# EAGLE design Backplane_v2 (EAGLE 9.6.2)
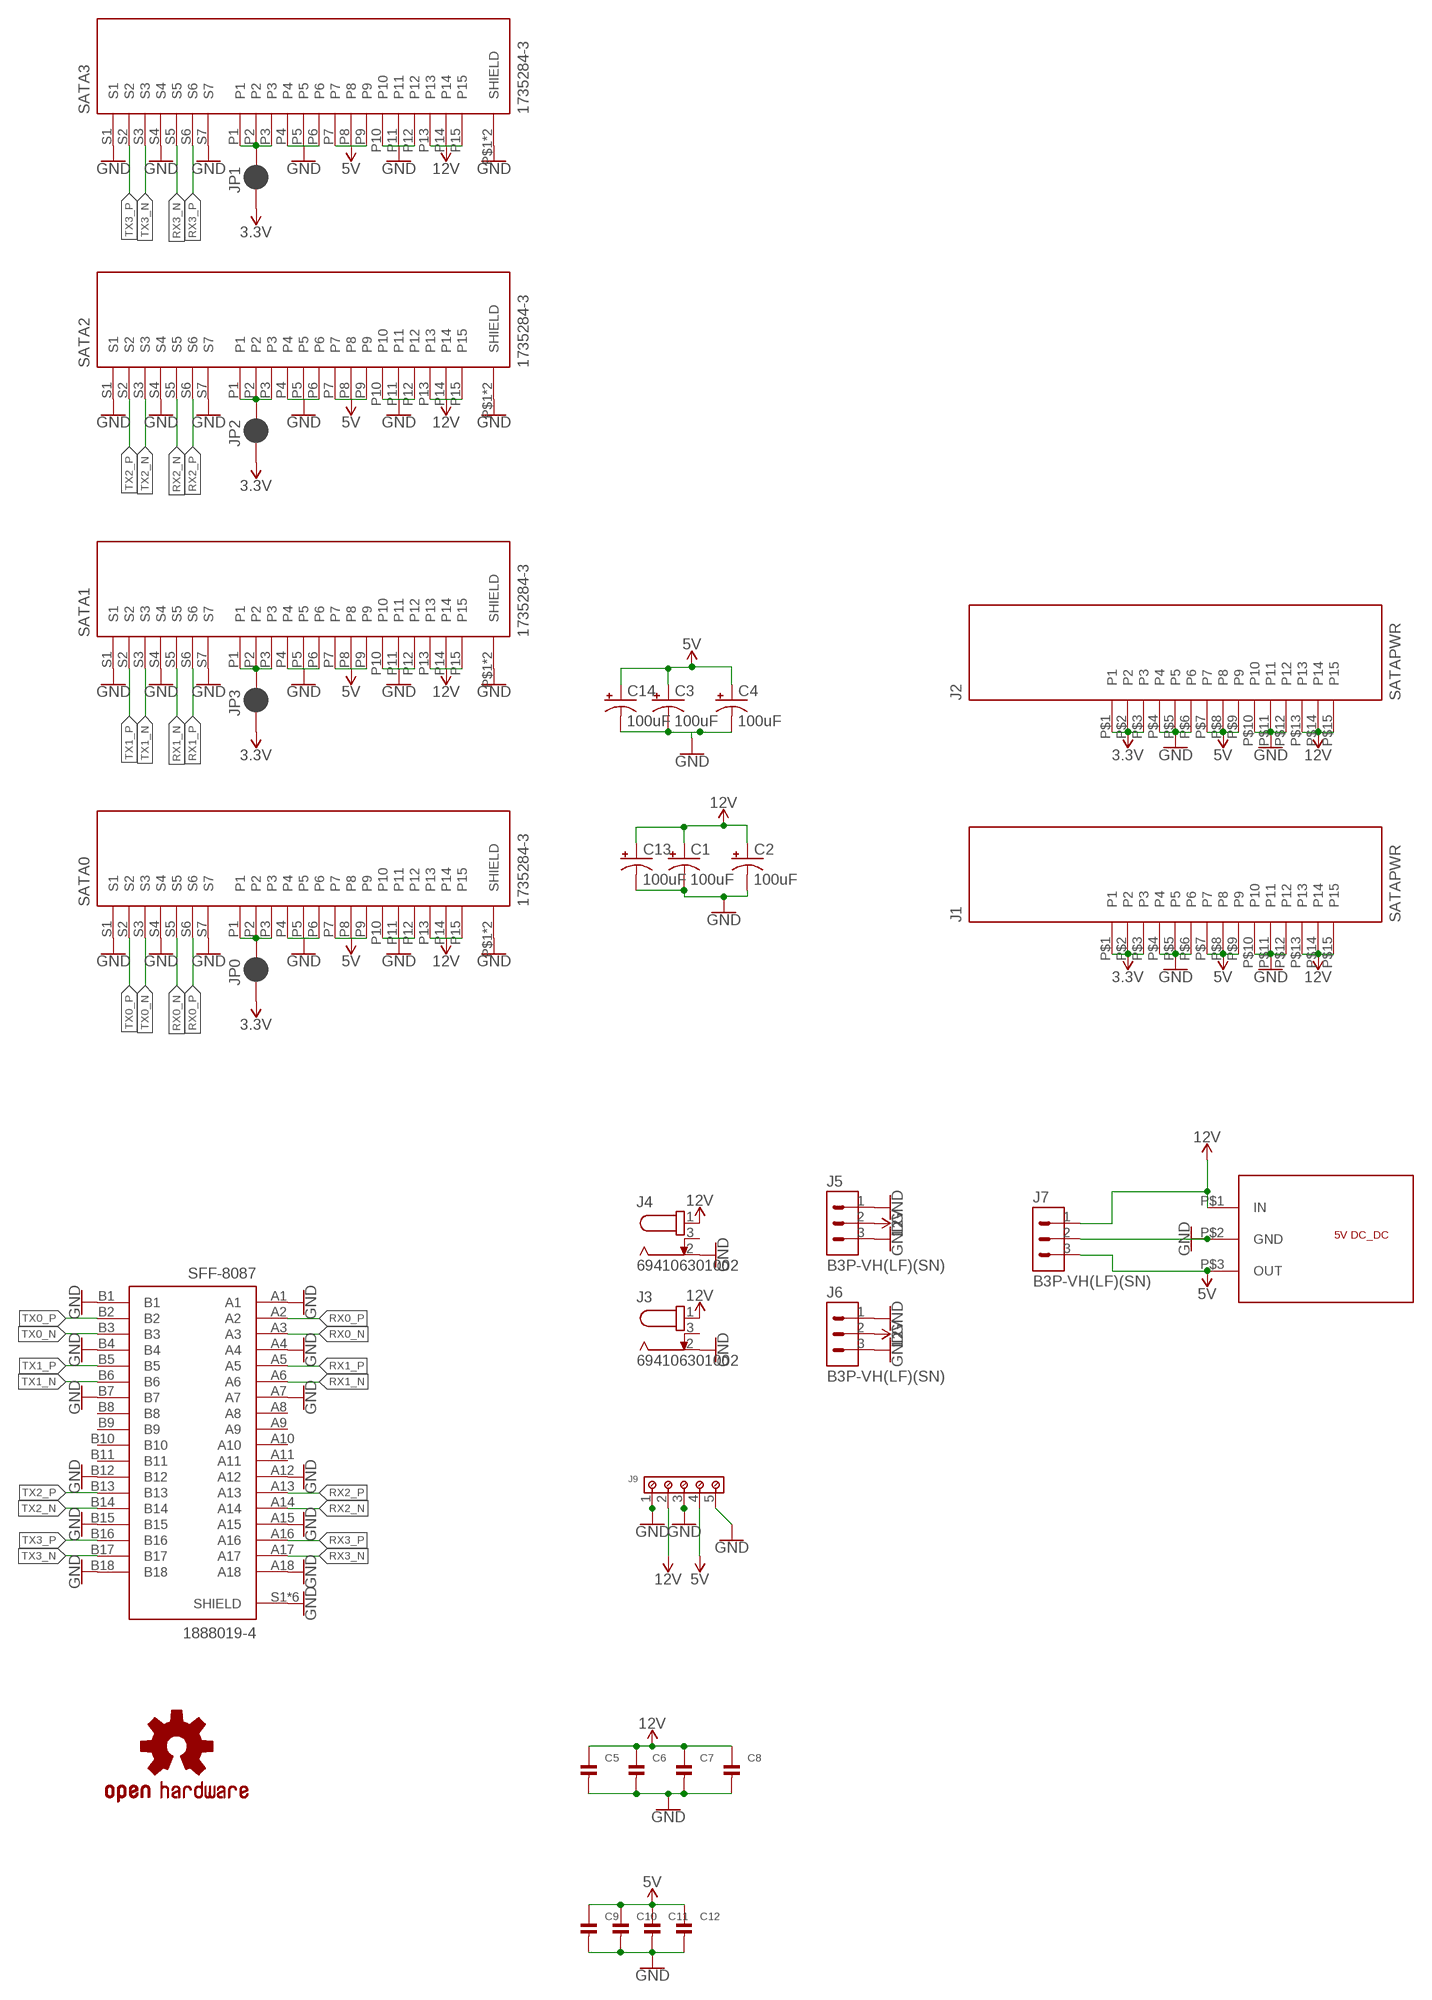
[diagram p0: schematic, sheet 1]

## Parts
C1  100uF  100UF-POLAR-25V-20%(ELEC)  [PANASONIC_D]
C2  100uF  100UF-POLAR-25V-20%(ELEC)  [PANASONIC_D]
C3  100uF  100UF-POLAR-25V-20%(ELEC)  [PANASONIC_D]
C4  100uF  100UF-POLAR-25V-20%(ELEC)  [PANASONIC_D]
C5  CAP_CERAMIC0805  [C0805]
C6  CAP_CERAMIC0805  [C0805]
C7  CAP_CERAMIC0805  [C0805]
C8  CAP_CERAMIC0805  [C0805]
C9  CAP_CERAMIC0805  [C0805]
C10  CAP_CERAMIC0805  [C0805]
C11  CAP_CERAMIC0805  [C0805]
C12  CAP_CERAMIC0805  [C0805]
C13  100uF  100UF-POLAR-25V-20%(ELEC)  [PANASONIC_D]
C14  100uF  100UF-POLAR-25V-20%(ELEC)  [PANASONIC_D]
J1  SATAPWR  [PTH_90]
J2  SATAPWR  [PTH_90]
J3  694106301002  [694106301002]
J4  694106301002  [694106301002]
J5  B3P-VH(LF)(SN)  [HDR-03]
J6  B3P-VH(LF)(SN)  [HDR-03]
J7  B3P-VH(LF)(SN)  [HDR-03]
J9  691243410005  [691243410005]
JP0  JUMPER-SMT_2_NC_PASTE_SILK  [SMT-JUMPER_2_NC_PASTE_SILK]
JP1  JUMPER-SMT_2_NC_PASTE_SILK  [SMT-JUMPER_2_NC_PASTE_SILK]
JP2  JUMPER-SMT_2_NC_PASTE_SILK  [SMT-JUMPER_2_NC_PASTE_SILK]
JP3  JUMPER-SMT_2_NC_PASTE_SILK  [SMT-JUMPER_2_NC_PASTE_SILK]
LOGO1  OSHW-LOGOL  [OSHW-LOGO-L]
SATA0  1735284-3  2023246-21735284-3  [TE_2023246-2]
SATA1  1735284-3  2023246-21735284-3  [TE_2023246-2]
SATA2  1735284-3  2023246-21735284-3  [TE_2023246-2]
SATA3  1735284-3  2023246-21735284-3  [TE_2023246-2]
SFF-8087  1888019-4  [TE_1888019-4]
U$1  5V_DC_DC  [5V_15W_DC_DC]

## Nets
3.3V: J1.P$1(P1) J1.P$2(P2) J1.P$3(P3) J2.P$1(P1) J2.P$2(P2) J2.P$3(P3) JP0.1 JP1.1 JP2.1 JP3.1
5V: C3.+ C4.+ C9.1 C10.1 C11.1 C12.1 C14.+ J1.P$7(P7) J1.P$8(P8) J1.P$9(P9) J2.P$7(P7) J2.P$8(P8) J2.P$9(P9) J7.3 J9.4 SATA0.P7 SATA0.P8 SATA0.P9 SATA1.P7 SATA1.P8 SATA1.P9 SATA2.P7 SATA2.P8 SATA2.P9 SATA3.P7 SATA3.P8 SATA3.P9 U$1.P$3(OUT)
12V: C1.+ C2.+ C5.1 C6.1 C7.1 C8.1 C13.+ J1.P$13(P13) J1.P$14(P14) J1.P$15(P15) J2.P$13(P13) J2.P$14(P14) J2.P$15(P15) J3.1 J4.1 J5.2 J6.2 J7.1 J9.2 SATA0.P13 SATA0.P14 SATA0.P15 SATA1.P13 SATA1.P14 SATA1.P15 SATA2.P13 SATA2.P14 SATA2.P15 SATA3.P13 SATA3.P14 SATA3.P15 U$1.P$1(IN)
GND: C1.- C2.- C3.- C4.- C5.2 C6.2 C7.2 C8.2 C9.2 C10.2 C11.2 C12.2 C13.- C14.- J1.P$4(P4) J1.P$5(P5) J1.P$6(P6) J1.P$10(P10) J1.P$11(P11) J1.P$12(P12) J2.P$4(P4) J2.P$5(P5) J2.P$6(P6) J2.P$10(P10) J2.P$11(P11) J2.P$12(P12) J3.2 J4.2 J5.1 J5.3 J6.1 J6.3 J7.2 J9.1 J9.3 J9.5 SATA0.P4 SATA0.P5 SATA0.P6 SATA0.P10 SATA0.P11 SATA0.P12 SATA0.P$1(SHIELD) SATA0.P$2(SHIELD) SATA0.S1 SATA0.S4 SATA0.S7 SATA1.P4 SATA1.P5 SATA1.P6 SATA1.P10 SATA1.P11 SATA1.P12 SATA1.P$1(SHIELD) SATA1.P$2(SHIELD) SATA1.S1 SATA1.S4 SATA1.S7 SATA2.P4 SATA2.P5 SATA2.P6 SATA2.P10 SATA2.P11 SATA2.P12 SATA2.P$1(SHIELD) SATA2.P$2(SHIELD) SATA2.S1 SATA2.S4 SATA2.S7 SATA3.P4 SATA3.P5 SATA3.P6 SATA3.P10 SATA3.P11 SATA3.P12 SATA3.P$1(SHIELD) SATA3.P$2(SHIELD) SATA3.S1 SATA3.S4 SATA3.S7 SFF-8087.A1 SFF-8087.A4 SFF-8087.A7 SFF-8087.A12 SFF-8087.A15 SFF-8087.A18 SFF-8087.B1 SFF-8087.B4 SFF-8087.B7 SFF-8087.B12 SFF-8087.B15 SFF-8087.B18 SFF-8087.S1(SHIELD) SFF-8087.S2(SHIELD) SFF-8087.S3(SHIELD) SFF-8087.S4(SHIELD) SFF-8087.S5(SHIELD) SFF-8087.S6(SHIELD) U$1.P$2(GND)
N$1: JP1.2 SATA3.P1 SATA3.P2 SATA3.P3
N$2: JP2.2 SATA2.P1 SATA2.P2 SATA2.P3
N$3: JP3.2 SATA1.P1 SATA1.P2 SATA1.P3
N$4: JP0.2 SATA0.P1 SATA0.P2 SATA0.P3
RX0_N [RX0]: SATA0.S5 SFF-8087.A3
RX0_P [RX0]: SATA0.S6 SFF-8087.A2
RX1_N [RX1]: SATA1.S5 SFF-8087.A6
RX1_P [RX1]: SATA1.S6 SFF-8087.A5
RX2_N [RX2]: SATA2.S5 SFF-8087.A14
RX2_P [RX2]: SATA2.S6 SFF-8087.A13
RX3_N [RX3]: SATA3.S5 SFF-8087.A17
RX3_P [RX3]: SATA3.S6 SFF-8087.A16
TX0_N [TX0]: SATA0.S3 SFF-8087.B3
TX0_P [TX0]: SATA0.S2 SFF-8087.B2
TX1_N [TX1]: SATA1.S3 SFF-8087.B6
TX1_P [TX1]: SATA1.S2 SFF-8087.B5
TX2_N [TX2]: SATA2.S3 SFF-8087.B14
TX2_P [TX2]: SATA2.S2 SFF-8087.B13
TX3_N [TX3]: SATA3.S3 SFF-8087.B17
TX3_P [TX3]: SATA3.S2 SFF-8087.B16
Unconnected: J3.3 J4.3 SFF-8087.A8 SFF-8087.A9 SFF-8087.A10 SFF-8087.A11 SFF-8087.B8 SFF-8087.B9 SFF-8087.B10 SFF-8087.B11

## Library data of the parts
C1-C4 C13 C14 = SparkFun-Capacitors:100UF-POLAR: 100µF polarized capacitors A capacitor is a passive two-terminal electrical component used to store electrical energy temporarily in an electric field.; PROD_ID: CAP-12547
C5-C12 = LU r11.5:CAP_CERAMIC: Ceramic Capacitors 0402 - 0402 Surface Mount Capacitors 16pF 50V 5% [Digikey: 445-4899-2-ND] 18pF 50V 5% [Digikey: 490-1281-2-ND] 22pF 50V 5% [Digikey: 490-1283-2-ND] 68pF 50V 5% [Digikey: 490-1289-2-ND] 0.1uF 10V 10% [Digikey: 490-1318-2-ND] 1.0uF 6.3V 10% [Digikey: 490-1320-2-ND] 0603 - 0603 Surface Mount Capacitors 16 pF 50V 5% [Digikey: 445-5051-2-ND] 22 pF 50V [Digikey: PCC220ACVTR-ND] 33 pF 50V 5% [Digikey: 490-1415-1-ND] 56pF 50V 5% [Digikey: 490-1421-1-ND] 220pF 50V 5% [Digikey: 445-1285-1-ND] 680 pF 50V 2200 pF 50V 5% C0G [Digikey: 445-1297-1-ND] 5600 pF 100V 5% X7R [Digikey: 478-3711-1-ND] 0.1 µF 25V 10% [Digikey: PCC2277TR-ND] 0.22 µF 16V 10% X7R [Digikey: 445-1318-1-ND] 1.0 µF 25V 10% [Digikey: 445-5146-2-ND] 0603 - RF Specific 3pF 250V +/-0.1pF RF [Digikey: 712-1347-1-ND] 18 pF 250V 5% [Digikey: 478-3505-1-ND or 712-1322-1-ND] 56 pF 250V 5% C0G RF [Digikey: 490-4867-1-ND] 68 pF 250V RF [Digikey: 490-4868-1-ND] 0805 - 0805 Surface Mount Capacitors 220 pF 250V 2% RF Ceramic Capacitor [Digikey: 712-1398-1-ND] 1000 pF 50V 2% NP0 Ceramic Capacitor [Digikey: 478-3760-1-ND] 0.1 µF 25V 10% Ceramic Capacitor [Digikey: PCC1828TR-ND] 1.0 µF 16V 10% Ceramic Capacitor[Digikey: 490-1691-2-ND] 10.0 µF 10V 10% Ceramic Capacitor[Digikey: 709-1228-1-ND] 10.0 uF 16V 10% Ceramic Capacitor [Digikey: 478-5165-2-ND] 47 uF 6.3V 20% Ceramic Capacitor [Digikey: 587-1779-1-ND or 399-5506-1-ND] 1206 - 1206 Surface Mount Capacitors 47uF 10V 20% Ceramic Capacitor [Digikey: 490-5528-1-ND or 399-5508-1-ND or 445-6010-1-ND] 100uF 6.3V -20%, +80% Y5V Ceramic Capacitor (Digikey: 490-4512-1-ND, Mouser: 81-GRM31CF50J107ZE1L)
J1 J2 = SATA_Power_(v2~recovered):SATAPWR: Conn SATA RCP 22 POS 1.27mm Solder RA SMD 22 Terminal 1 Port Tray Check availability <https://pricing.snapeda.com/parts/2023246-2/TE%20Connectivity/view-part?ref=eda>
J3 J4 = DC Power Jacks:694106301002: CONN PWR JACK 2.1X5.5MM SOLDER Manufacturer's datasheet <https://katalog.we-online.de/em/datasheet/6941xx301002.pdf>; CREATED_BY: PCBLayout.com; DIGIKEY_PART_NUMBER: 732-5930-ND; MANUFACTURER: Wurth Electronics Inc.; MPN: 694106301002
J5-J7 = Connectors:B3P-VH(LF)(SN): CONN HEADER VERT 3POS 3.96MM Manufacturer's datasheet <http://www.jst-mfg.com/product/pdf/eng/eVH.pdf>; CREATED_BY: PCBLayout.com; DIGIKEY_PART_NUMBER: 455-1640-ND; MANUFACTURER: JST Sales America Inc.; MPN: B3P-VH(LF)(SN)
J9 = Wurth_Connectors_WR-TBL Rising Cage Clamp:691243410005: WR-TBL Serie 2434 - 7.62 mm Horizontal Entry Modular w. Rising Cage Clamp KIND PROPERTIES Pitch 7.62 mm MATERIAL PROPERTIES Insulator Material PA66 Insulator Flammability Rating UL94 V-0 Contact Material Copper Alloy Contact Plating Tin over Nickel Terminal Screw Material Steel Terminal Screw Plating Zinc Wire Guard Material Copper Alloy GENERAL INFORMATION Operating Temperature -30 up to +120 °C Compliance RoHS ELECTRICAL PROPERTIES IR UL 10 A IR VDE 10 A Working Voltage [UL] 300 V (AC) Working Voltage [VDE] 450 V (AC) Withstanding Voltage [UL] 1600 V (AC) Withstanding Voltage [cULus] 1600 V (AC) Withstanding Voltage [VDE] 2500 V (AC) Contact Resistance [UL] 20 mΩ Contact Resistance [cULus] 20 mΩ Contact Resistance [VDE] 20 mΩ MECHANICAL PROPERTIES Wire Strip Length 6 Screw M2 CERTIFICATION cULus Approval E150931 VDE Approval 40015434 PACKAGING PROPERTIES Packaging Box <https://www.we-online.com/catalog/media/o60871v209%20Family_TBL_7_62_2434_VERTICAL_CABLE_ENTRY_W_RISING_CLAMP_6912434100xx.jpg> Details see: https://www.we-online.com/catalog/en/TBL_7_62_2434_VERTICAL_CABLE_ENTRY_W_RISING_CLAMP_6912434100xx/ Updated by Ella Wu 2019-11-27 2019(C) Wurth Elektronik; IR-UL: 10A; IR-VDE: 10A; PART-NUMBER: 691243410005; PINS: 5; PITCH: 7.62mm; TYPE: Horizontal; WIRE: 12 to 30 (AWG) 3.31 to 0.0509 (mm²); WORKING-VOLTAGE-UL: 300V (AC); WORKING-VOLTAGE-VDE: 450V (AC)
JP0 JP1-JP3 = SparkFun-Jumpers:JUMPER-SMT_2_NC_PASTE: Normally closed solder jumper This jumper has an aperture in the stencil to allow solder paste to bridge the split in the wire so it's normally closed (NC). Wick off the solder to open the connection. Reapply solder to reclose the connection.
LOGO1 = SparkFun-Aesthetics:OSHW-LOGO: Open-Source Hardware (OSHW) Logo This logo indicates the piece of hardware it is found on incorporates a OSHW license and/or adheres to the definition of open source hardware found here: http://freedomdefined.org/OSHW
SATA0 SATA1-SATA3 = 2023246-2:2023246-2: Conn SATA RCP 22 POS 1.27mm Solder RA SMD 22 Terminal 1 Port Tray Check availability <https://pricing.snapeda.com/parts/2023246-2/TE%20Connectivity/view-part?ref=eda>; AVAILABILITY: In Stock; COMMENT: 2023246-2; DESCRIPTION: Conn SATA RCP 22 POS 1.27mm Solder RA SMD 22 Terminal 1 Port Tray; MF: TE Connectivity; MP: 2023246-2; PACKAGE: None; PRICE: None; PURCHASE-URL: https://pricing.snapeda.com/search/part/2023246-2/?ref=eda
SFF-8087 = 1888019-4:1888019-4: Receptacle; Shielded; EVERCLEAR Mini-SAS; Internal; RA Combo; 36 Pos.; Dual Key; COMMENT: 1888019-4; DESCRIPTION: Conn Card Edge SKT 36 POS 0.8mm Solder RA SMD T/R; DIGI-KEY_PART_NUMBER: A111092CT-ND; MF: TE Connectivity; MP: 1888019-4; PACKAGE: None; PURCHASE-URL: https://pricing.snapeda.com/search/part/1888019-4/?ref=eda
U$1 = SATA_Power_(v2~recovered):5V_DC_DC

## Board
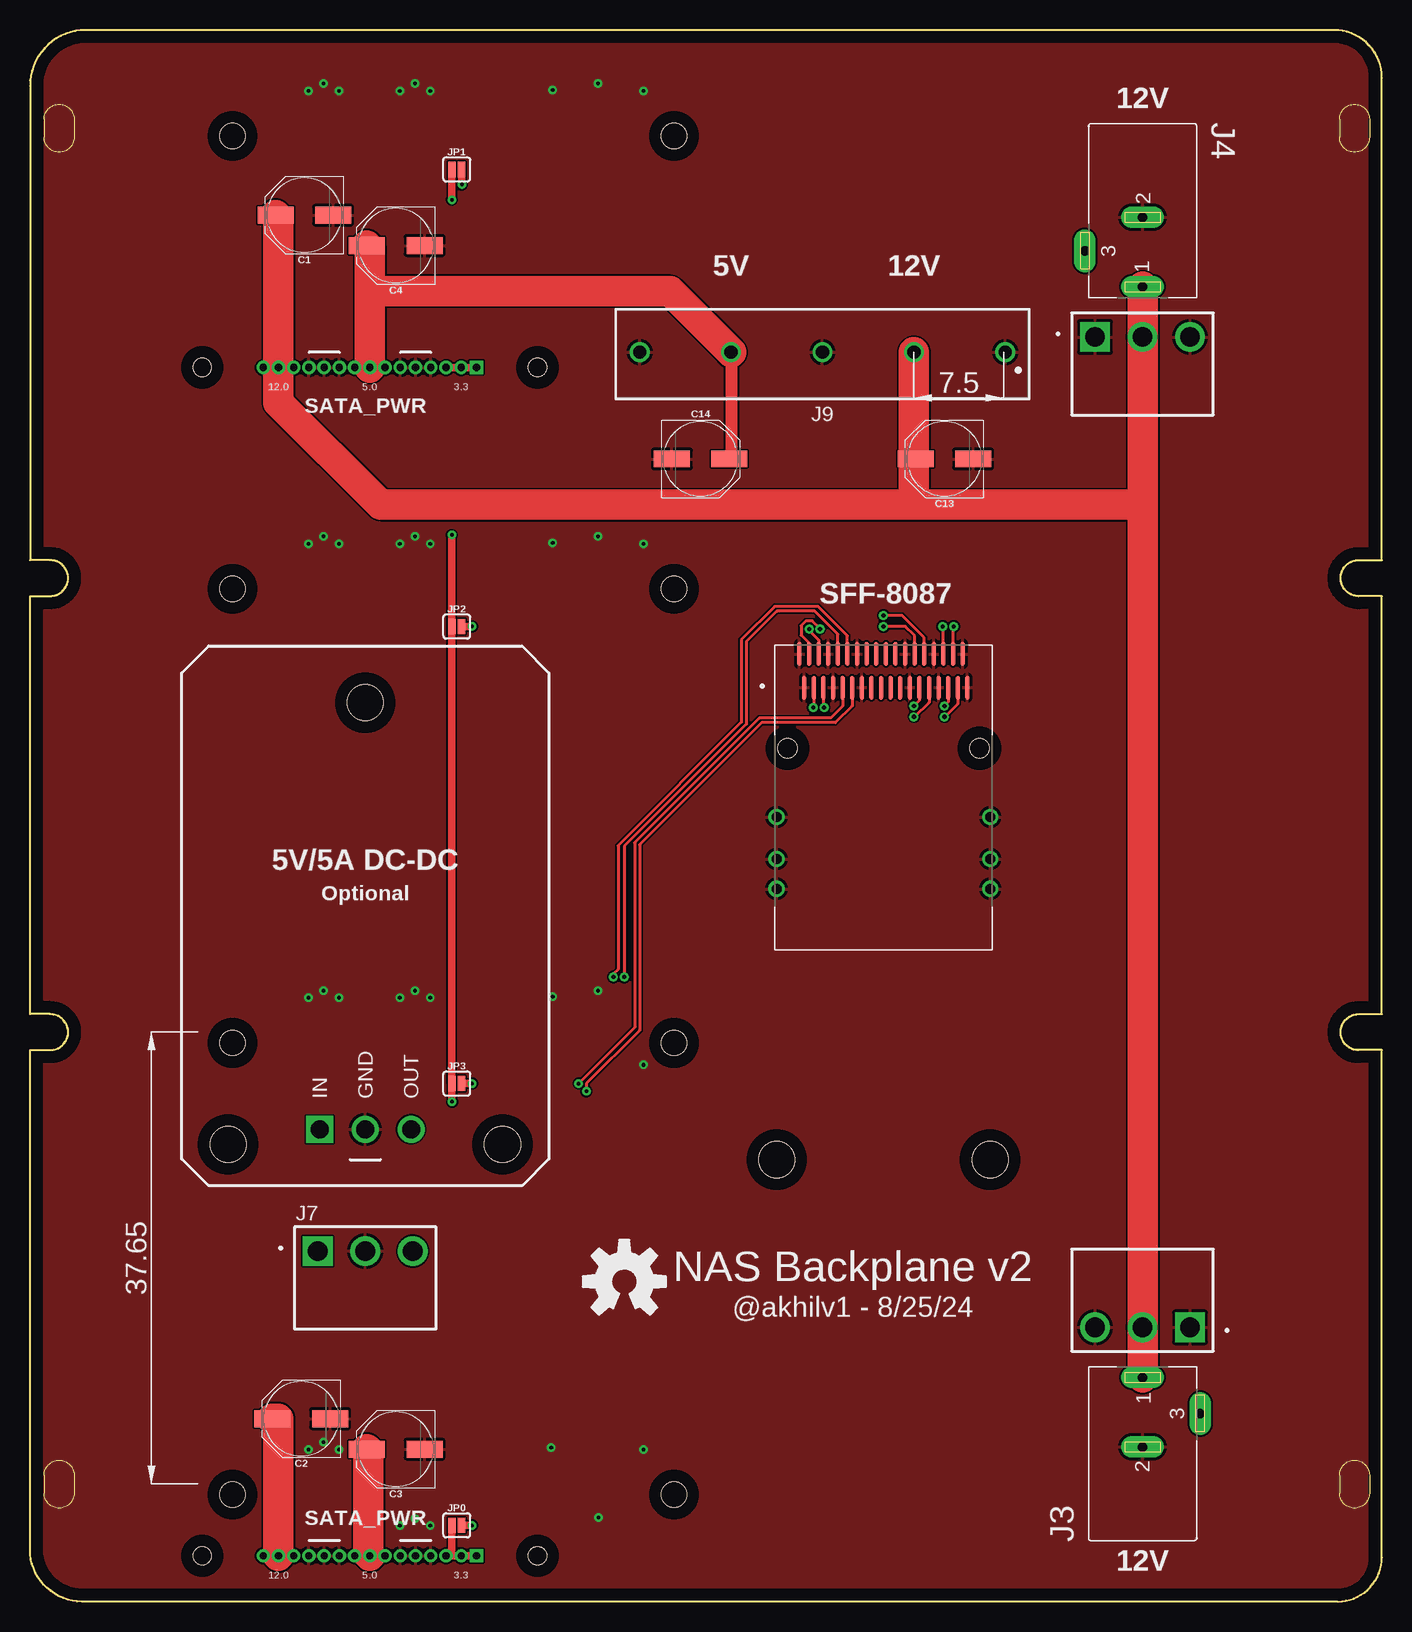
[diagram p1: board, top side]
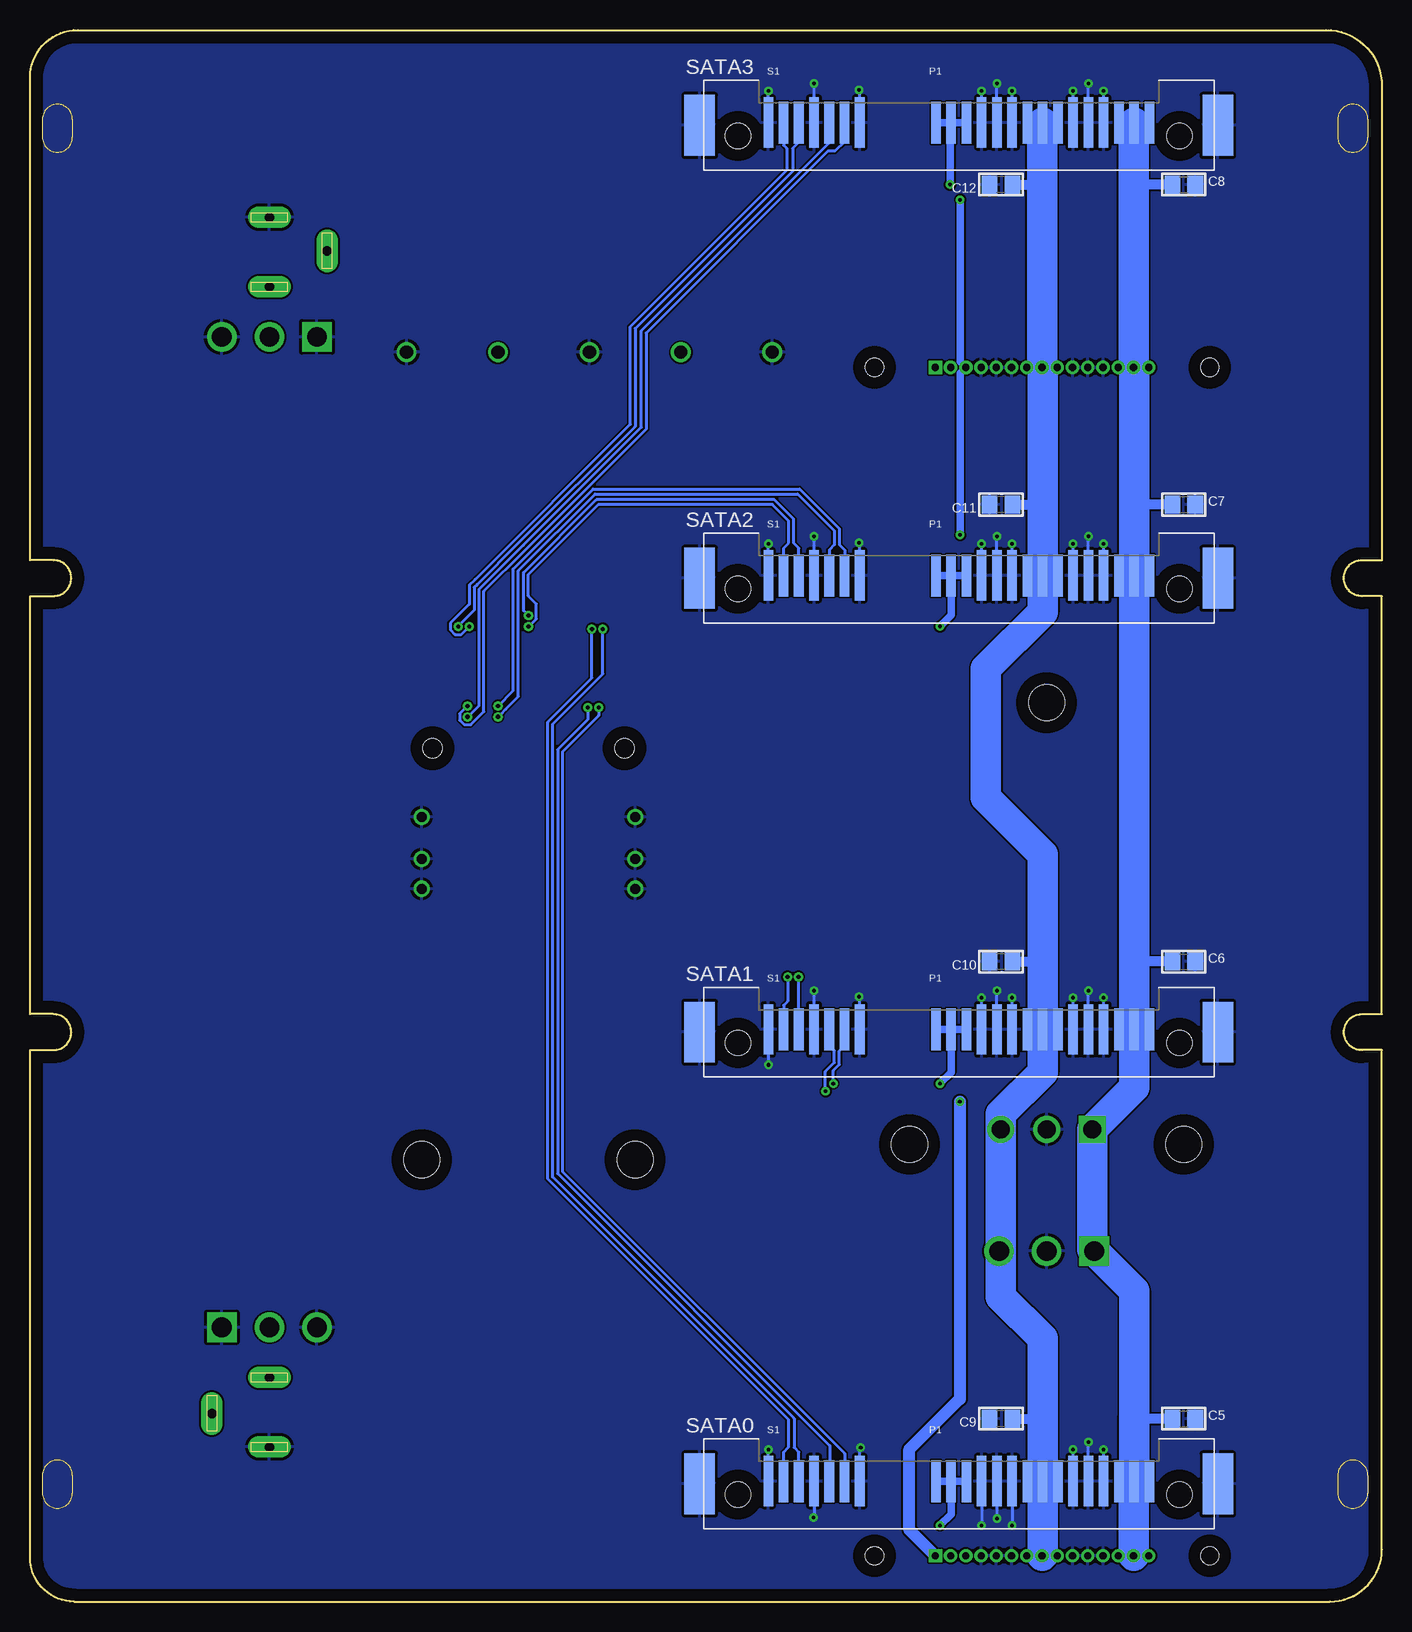
[diagram p2: board, bottom side, seen from below]

Size 112.66 x 131 mm. Coordinates in mm from the lower left corner, seen from the top.
Outline: 108.98,0 4.34,0 arc-90 0,4.34 0,45.96 1.68,45.96 arc90 3.17,47.46 arc90 1.68,48.96 0,48.96 0,83.81 1.68,83.81 arc90 3.17,85.31 arc90 1.68,86.81 0,86.81 0,126.34 arc-90 4.66,131 108.68,131 arc-90 112.66,127.02 112.66,86.81 110.72,86.81 arc90 109.22,85.31 arc90 110.72,83.81 112.66,83.81 112.66,48.96 110.72,48.96 arc90 109.22,47.46 arc90 110.72,45.96 112.66,45.96 112.66,3.68 arc-90 108.98,0
Copper layers (1*16): Top 0.035mm / dielectric 1.5mm / Bottom 0.035mm
Design rules "default": minimum track width 6mil, minimum drill 0.35mm, track to track 6mil, track to pad 6mil, pad to pad 6mil, via to via 6mil, smd to smd 6mil, copper to edge 40mil, drill to drill 6mil, minimum pad ring 10mil, minimum via ring 8mil, stop-mask expansion 4mil, vias tented up to drill 0mil, thermal gap 10mil
Holes 3 mm at 62.23,36.83 80.01,36.83
Milling: 16 lines

### Footprints (pad centres in the part's own frame; a part is rotated, then mirrored left to right if it is on the bottom)
PANASONIC_D = smd 3 x 1.4: + 2.4,0; - -2.4,0
C0805 = smd 1.3 x 1.5: 1 -0.95,0; 2 0.95,0
PTH_90 = drill 0.6 pad 1.016 square: P$1 0,0 | drill 0.6 pad 1.016: P$2 1.27,0; P$3 2.54,0; P$4 3.81,0; P$5 5.08,0; P$6 6.35,0; P$7 7.62,0; P$8 8.89,0; P$9 10.16,0; P$10 11.43,0; P$11 12.7,0; P$12 13.97,0; P$13 15.24,0; P$14 16.51,0; P$15 17.78,0 | hole 1.5: 22.86,0; -5.08,0
694106301002 = drill 0.8 pad 1.8 long: 1 13.6,0; 2 7.8,0; 3 10.6,-4.8
HDR-03 = drill 1.65 square: 1 -3.96,0 | drill 1.65: 2 0,0; 3 3.96,0
691243410005 = drill 1.1: 1 -15.24,0; 2 -7.62,0; 3 0,0; 4 7.62,0; 5 15.24,0
SMT-JUMPER_2_NC_PASTE_SILK = smd 0.635 x 1.27: 1 -0.406,0; 2 0.406,0
TE_2023246-2 = smd 0.8 x 3.5: P1 -1.905,0.23; P2 -0.635,0.23; P3 0.635,0.23; P7 5.715,0.23; P8 6.985,0.23; P9 8.255,0.23; P13 13.335,0.23; P14 14.605,0.23; P15 15.875,0.23; S2 -14.605,0.23; S3 -13.335,0.23; S5 -10.795,0.23; S6 -9.525,0.23 | smd 0.8 x 4.2: P4 1.905,0.23; P5 3.175,0.23; P6 4.445,0.23; P10 9.525,0.23; P11 10.795,0.23; P12 12.065,0.23; S1 -15.875,0.23; S4 -12.065,0.23; S7 -8.255,0.23 | smd 2.54 x 5.08: P$1 -21.59,0; P$2 21.59,0 | hole 2.1: 18.4,-0.9; -18.4,-0.9
TE_1888019-4 = smd 0.351 x 2.032: A1 -6.6,5.055; A2 -5.8,5.055; A3 -5,5.055; A4 -4.2,5.055; A5 -3.4,5.055; A6 -2.6,5.055; A7 -1.8,5.055; A8 -1,5.055; A9 -0.2,5.055; A10 0.6,5.055; A11 1.4,5.055; A12 2.2,5.055; A13 3,5.055; A14 3.8,5.055; A15 4.6,5.055; A16 5.4,5.055; A17 6.2,5.055; A18 7,5.055; B2 -6.2,7.874; B3 -5.4,7.874; B4 -4.6,7.874; B5 -3.8,7.874; B6 -3,7.874; B7 -2.2,7.874; B8 -1.4,7.874; B9 -0.6,7.874; B10 0.2,7.874; B11 1,7.874; B12 1.8,7.874; B13 2.6,7.874; B14 3.4,7.874; B15 4.2,7.874; B16 5,7.874; B17 5.8,7.874; B18 6.6,7.874 | smd 0.35 x 2.032: B1 -7,7.874 | drill 0.85: S1 -8.9,-5.72; S2 8.9,-5.72; S3 -8.9,-9.22; S4 8.9,-9.22; S5 -8.9,-11.712; S6 8.9,-11.712 | hole 1.59: -8,0; 8,0
5V_15W_DC_DC = drill 1.5 square: P$1 -3.81,-17.78 | drill 1.5: P$2 0,-17.78; P$3 3.81,-17.78 | hole 3: 0,17.78; -11.43,-19.05; 11.43,-19.05

### Placement (x,y rotation side)
C1  22.86,115.57 180 top
C2  22.61,15.24 180 top
C3  30.48,12.7 180 top
C4  30.48,113.03 180 top
C5  16.51,15.24 0 bottom
C6  16.51,53.34 0 bottom
C7  16.51,91.44 0 bottom
C8  16.51,118.11 0 bottom
C9  31.75,15.24 180 bottom
C10  31.75,53.34 180 bottom
C11  31.75,91.44 180 bottom
C12  31.75,118.11 180 bottom
C13  76.2,95.25 180 top
C14  55.88,95.25 0 top
J1  37.21,102.87 180 top
J2  37.21,3.81 180 top
J3  92.71,5.08 90 top
J4  92.71,123.19 270 top
J5  92.71,22.86 180 top
J6  92.71,105.41 0 top
J7  27.94,29.21 0 top
J9  66.04,104.14 180 top
JP0  35.56,6.35 0 top
JP1  35.56,119.38 0 top
JP2  35.56,81.28 0 top
JP3  35.56,43.18 0 top
LOGO1  49.53,26.67 0 top
SATA0  35.26,9.81 0 bottom
SATA1  35.26,47.46 0 bottom
SATA2  35.26,85.31 0 bottom
SATA3  35.26,123.06 0 bottom
SFF-8087  71.12,71.12 0 top
U$1  27.94,57.15 0 top

### Tracks (layer width: path | path; a pad name or v marks a point on that pad's centre or on a via)
3.3V  (via drill 0.3)
  Top 0.61: J1.P$1 J1.P$2 J1.P$3 | J2.P$1 J2.P$2 J2.P$3 35.15,4.29 JP0.1 | v35.15,88.9 JP2.1 JP3.1 35.15,41.68 v35.18,41.66 | JP1.1 v35.15,116.84
  Bottom 0.61: v35.15,88.9 35.15,102.39 J1.P$3 35.15,103.35 v35.15,116.84
  Bottom 1.016: J2.P$1 39.37,5.97 39.37,12.7 35.18,16.89 v35.18,41.66
5V
  Top 0.61: J1.P$9 J1.P$8 J1.P$7 | J2.P$9 27.19,3.95 28.18,3.95 | J2.P$7 J2.P$8
  Top 0.813: C14.+ 58.36,95.33
  Top 1.016: J9.4 58.42,95.39 C14.+
  Top 2.54: C4.+ 28.32,112.79 28.32,109.22 | 28.32,109.22 J1.P$8 | C3.+ 28.18,12.6 28.18,3.95 J2.P$8 | J9.4 53.34,109.22 28.32,109.22
  Bottom 0.61: SATA0.P9 SATA0.P8 SATA0.P7 | SATA1.P9 SATA1.P8 SATA1.P7 | SATA2.P9 SATA2.P8 SATA2.P7 | SATA3.P9 SATA3.P8 | SATA3.P7 29.5,123.24 28.32,123.24
  Bottom 0.813: C12.1 28.32,118.11 | C11.1 28.27,91.44 27.94,91.44 | C10.1 28.27,53.34 | C9.1 28.27,15.24
  Bottom 2.54: J2.P$8 28.27,3.86 SATA0.P8 28.27,15.24 28.27,21.93 31.75,25.4 31.75,29.06 J7.3 31.75,29.36 U$1.P$3 31.75,40.64 28.27,44.12 SATA1.P8 28.27,53.34 28.27,62.29 33,67.01 33,77.77 28.27,82.49 SATA2.P8 28.27,91.44 28.27,102.82 J1.P$8 28.32,118.11 28.32,123.24 SATA3.P8
12V
  Top 0.61: J2.P$15 J2.P$14 J2.P$13 | J1.P$15 J1.P$14 J1.P$13
  Top 0.813: C13.+ 73.66,95.25
  Top 2.54: C1.+ 20.7,115.33 J1.P$14 20.7,99.95 29.21,91.44 73.66,91.44 | C2.+ 20.7,15.24 J2.P$14 | 92.71,91.44 J6.2 J4.1 | 92.71,91.44 J3.1 J5.2 | 73.66,91.44 92.71,91.44 | 73.66,91.44 73.66,95.25 J9.2
  Bottom 0.61: SATA0.P15 SATA0.P14 | SATA0.P13 20.75,10.04 20.7,9.99 | SATA1.P15 SATA1.P14 SATA1.P13 | SATA2.P15 SATA2.P14 SATA2.P13 | SATA3.P15 SATA3.P14 SATA3.P13
  Bottom 0.813: C8.1 20.7,118.11 | C7.1 20.66,91.44 | C6.1 20.66,53.34 | C5.1 20.66,15.24
  Bottom 2.54: SATA3.P14 20.7,123.24 20.7,118.11 J1.P$14 20.66,102.82 20.66,91.44 SATA2.P14 20.66,53.34 SATA1.P14 20.66,42.84 U$1.P$1 24.13,29.36 J7.1 20.66,25.89 20.66,15.24 SATA0.P14 20.7,9.99 J2.P$14
GND  (via drill 0.3)
  Bottom 0.254: SATA3.S1 v51.13,125.92 | SATA3.S4 v47.33,126.53 | SATA3.P4 v33.35,125.92 | SATA3.P5 v32.09,126.53 | SATA3.P6 v30.82,125.92 | SATA3.P10 v25.73,125.92 | SATA3.P11 v24.46,126.53 | SATA3.P12 v23.2,125.92 | SATA1.S1 v51.13,44.73 | SATA1.S4 v47.33,50.93 | SATA1.P4 v33.35,50.32 | SATA1.P5 v32.09,50.93 | SATA1.P6 v30.82,50.32 | SATA1.P10 v25.73,50.32 | SATA1.P11 v24.46,50.93 | SATA1.P12 v23.2,50.32 | SATA0.S1 v51.13,12.67 | SATA0.P4 v33.35,6.32 | SATA0.P5 v32.09,6.93 | SATA0.P6 v30.82,6.32 | SATA0.P10 v25.73,12.67 | SATA0.P11 v24.46,13.28 | SATA0.P12 v23.2,12.67 | SATA2.S1 v51.13,88.17 | SATA2.S4 v47.33,88.78 | SATA2.P4 v33.35,88.17 | SATA2.P5 v32.09,88.78 | SATA2.P6 v30.82,88.17 | SATA2.P10 v25.73,88.17 | SATA2.P11 v24.46,88.78 | SATA2.P12 v23.2,88.17 | SATA0.S4 47.33,7.03 v47.37,6.99 | SATA0.S7 43.52,12.75 v43.43,12.83 | SATA1.S7 43.52,50.37 v43.56,50.42 | SATA2.S7 43.52,88.22 v43.56,88.27 | SATA3.S7 43.52,125.94 v43.56,125.98
  pour Bottom: -6.35,139.7 128.27,139.7 128.27,-16.51 -6.35,-16.51
  pour Top: -5.08,138.43 129.54,138.43 129.54,-17.78 -5.08,-17.78
N$1  (via drill 0.3)
  Top 0.61: v35.99,118.11 35.97,118.13 JP1.2
  Bottom 0.61: SATA3.P3 SATA3.P2 | SATA3.P2 SATA3.P1 | SATA3.P2 35.99,123.2 v35.99,118.11
N$2  (via drill 0.3)
  Top 0.61: v36.83,81.28 JP2.2
  Bottom 0.61: SATA2.P3 SATA2.P2 | SATA2.P2 SATA2.P1 | SATA2.P2 35.9,82.22 v36.83,81.28
N$3  (via drill 0.3)
  Top 0.61: v36.83,43.18 JP3.2
  Bottom 0.61: SATA1.P3 SATA1.P2 | SATA1.P2 SATA1.P1 | SATA1.P2 35.9,44.12 v36.83,43.18
N$4  (via drill 0.3)
  Top 0.61: v36.83,6.35 JP0.2
  Bottom 0.61: SATA0.P3 SATA0.P2 | SATA0.P2 SATA0.P1 | SATA0.P2 35.9,7.29 v36.83,6.35
RX0_N  (via drill 0.35)
  Top 0.254: SFF-8087.A3 66.12,74.58 v66.17,74.52
  Bottom 0.254: v66.17,74.52 66.17,73.53 68.7,71 68.7,35.68 46.01,12.99 46.01,10.08 SATA0.S5
RX0_P  (via drill 0.35)
  Top 0.254: SFF-8087.A2 65.32,74.58 v65.27,74.52
  Bottom 0.254: v65.27,74.52 65.27,73.86 68.29,70.83 68.29,35.85 44.78,12.34 SATA0.S6
RX1_N  (via drill 0.3)
  Top 0.254: SFF-8087.A6 68.52,74.65 67.12,73.25 60.96,73.25 50.8,63.09 50.8,47.61 46.36,43.17 v46.36,42.54
  Bottom 0.254: SATA1.S5 46.05,46.34 45.62,45.91 45.62,44.92 46.38,44.17 46.38,42.55 v46.36,42.54
RX1_P  (via drill 0.3)
  Top 0.254: SFF-8087.A5 67.72,74.65 66.73,73.66 60.79,73.66 50.39,63.26 50.39,47.85 v45.72,43.18
  Bottom 0.254: SATA1.S6 44.78,46.34 45.22,45.91 45.22,44.76 45.72,44.25 v45.72,43.18
RX2_N  (via drill 0.35)
  Top 0.254: SFF-8087.A14 74.92,74.95 73.71,73.74 v73.66,73.74
  Bottom 0.254: v73.66,73.74 73.41,73.99 73.39,73.99 73,74.38 73,74.4 71.96,75.44 71.96,85.93 65.56,92.33 48.7,92.33 45.62,89.25 45.62,88.08 46.05,87.65 SATA2.S5
RX2_P  (via drill 0.35)
  Top 0.254: SFF-8087.A13 74.12,75.11 v73.66,74.65
  Bottom 0.254: v73.66,74.65 72.39,75.92 72.39,86.07 65.73,92.73 48.53,92.73 45.22,89.42 45.22,88.09 44.78,87.66 SATA2.S6
RX3_N  (via drill 0.35)
  Top 0.254: SFF-8087.A17 77.32,74.83 76.23,73.74 v76.2,73.74
  Bottom 0.254: v76.2,73.74 76.18,73.74 75.23,74.69 75.23,84.38 71.55,88.06 | 71.55,88.06 | 71.55,88.06 61.72,97.89 61.72,105.92 46.05,121.58 SATA3.S5
RX3_P  (via drill 0.35)
  Top 0.254: SFF-8087.A16 76.52,74.97 v76.2,74.65
  Bottom 0.254: v76.2,74.65 76.22,74.65 76.86,74.01 76.86,73.47 76.47,73.08 75.93,73.08 74.83,74.18 74.83,84.21 71.41,87.63 | SATA3.S6 44.78,121.7 45.58,120.9 46.16,120.9 61.32,105.75 61.32,97.72 71.41,87.63 | 71.41,87.63
TX0_N  (via drill 0.35)
  Top 0.254: SFF-8087.B3 65.72,80.13 64.92,80.92 v64.92,81.07
  Bottom 0.254: SATA0.S3 48.59,12.45 48.98,12.83 48.98,15.26 69.11,35.39 69.11,73.14 64.92,77.31 v64.92,81.07
TX0_P  (via drill 0.35)
  Top 0.254: SFF-8087.B2 64.92,79.9 64.27,80.56 64.27,81.35 64.65,81.73 65.2,81.73 65.83,81.09 v65.83,81.07
  Bottom 0.254: SATA0.S2 49.87,12.45 49.48,12.83 49.48,15.19 69.51,35.22 69.51,73.3 65.83,76.98 v65.83,81.07
TX1_N  (via drill 0.35)
  Top 0.254: SFF-8087.B6 68.12,80.52 65.68,82.96 62.06,82.96 59.28,80.18 59.28,73.3 49,63.02 49,52.7 48.62,52.32 v48.62,52.07
  Bottom 0.254: SATA1.S3 48.62,47.72 v48.62,52.07
TX1_P  (via drill 0.35)
  Top 0.254: SFF-8087.B5 67.32,80.64 65.42,82.55 62.23,82.55 59.69,80.01 59.69,73.13 49.53,62.97 v49.53,52.07
  Bottom 0.254: SATA1.S2 49.87,49.7 49.53,50.04 v49.53,52.07
TX2_N  (via drill 0.35)
  Top 0.254: SFF-8087.B14 74.52,80.34 72.67,82.19 v71.12,82.19
  Bottom 0.254: SATA2.S3 48.59,87.8 49.03,88.23 49.03,90.24 50.63,91.85 65.47,91.85 71.53,85.79 71.53,82.59 v71.12,82.19
TX2_P  (via drill 0.35)
  Top 0.254: SFF-8087.B13 73.72,80.52 72.96,81.28 v71.12,81.28
  Bottom 0.254: SATA2.S2 49.87,87.8 49.43,88.23 49.43,90.07 50.8,91.44 65.3,91.44 71.12,85.62 71.12,83.82 70.46,83.16 70.46,81.92 71.1,81.28 v71.12,81.28
TX3_N  (via drill 0.35)
  Top 0.254: v76.97,81.28 76.92,81.23 SFF-8087.B17
  Bottom 0.254: 75.4,84.78 75.64,84.55 75.64,82.64 76.97,81.3 v76.97,81.28 | SATA3.S3 48.59,121.64 49.1,121.13 49.1,119.23 62.23,106.11 62.23,97.96 71.96,88.23 | 71.96,88.23 | 75.4,84.78 | 71.96,88.23 75.4,84.78
TX3_P  (via drill 0.35)
  Top 0.254: v76.07,81.28 76.12,81.23 SFF-8087.B16
  Bottom 0.254: v76.07,81.28 76.07,81.26 76.7,80.62 77.25,80.62 77.63,81.01 77.63,81.55 76.05,83.14 76.05,84.72 75.57,85.19 | 75.57,85.19 | SATA3.S2 49.87,121.39 49.61,121.13 49.61,119.3 62.64,106.27 62.64,98.13 75.57,85.19

### Text on the board
tPlace: 12V | 5V | 12V | SATA_PWR | 5V/5A DC-DC | Optional | NAS Backplane v2 | @akhilv1 - 8/25/24 | SATA_PWR | 12V